# Altium schematic sheet KX1_DB_DAC_2.SchDoc
size A
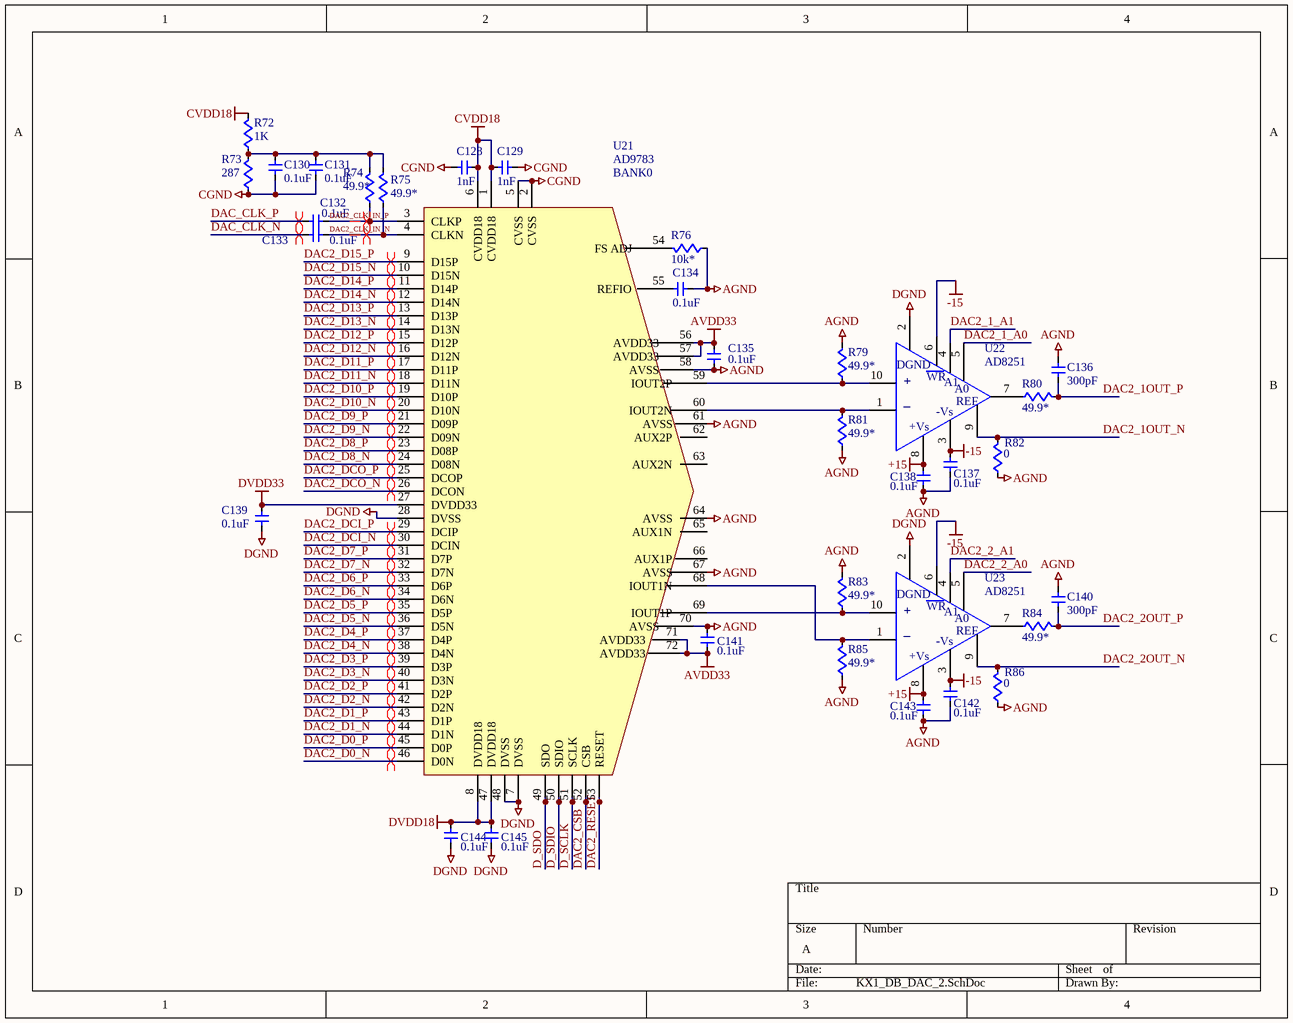
[diagram p0: KX1_DB_DAC_2.SchDoc]

## Parts
C128  1nF  [0603w]
C129  1nF  [0603w]
C130  0.1uF  [0603w]
C131  0.1uF  [0603w]
C132  0.1uF  [1206]
C133  0.1uF  [1206]
C134  0.1uF  [0603w]
C135  0.1uF  [0603w]
C136  300pF  [0603w]
C137  0.1uF  [0603w]
C138  0.1uF  [0603w]
C139  0.1uF  [0603w]
C140  300pF  [0603w]
C141  0.1uF  [0603w]
C142  0.1uF  [0603w]
C143  0.1uF  [0603w]
C144  0.1uF  [0603w]
C145  0.1uF  [0603w]
R72  1K  [0603w]
R73  287  [0603w]
R74  49.9*  [0603w]
R75  49.9*  [0603w]
R76  10k*  [0603w]
R79  49.9*  [0603w]
R80  49.9*  [0603w]
R81  49.9*  [0603w]
R82  0  [0603w]
R83  49.9*  [0603w]
R84  49.9*  [0603w]
R85  49.9*  [0603w]
R86  0  [0603w]
U21  AD9783  [LFCSP72]
U22  AD8251  [MSOP10sm]
U23  AD8251  [MSOP10sm]

## Nets
+15: C138.2 C143.2 U22.8 U23.8
-15: C137.2 C142.2 U22.3 U22.6 U23.3 U23.6
AGND: C134.2 C135.1 C136.2 C137.1 C138.1 C140.2 C141.2 C142.1 C143.1 R76.1 R79.2 R81.1 R82.1 R83.2 R85.1 R86.1 U21.58(AVSS) U21.61(AVSS) U21.64(AVSS) U21.67(AVSS) U21.70(AVSS)
AVDD33: C135.2 C141.1 U21.56(AVDD33) U21.57(AVDD33) U21.71(AVDD33) U21.72(AVDD33)
CGND: C128.2 C129.2 C130.2 C131.2 R73.1 U21.2(CVSS) U21.5(CVSS)
CVDD18: C128.1 C129.1 R72.2 U21.1(CVDD18) U21.6(CVDD18)
DGND: C139.2 C144.1 C145.1 U21.7(DVSS) U21.28(DVSS) U21.48(DVSS) U22.2 U23.2
DVDD18: C144.2 C145.2 U21.8(DVDD18) U21.47(DVDD18)
DVDD33: C139.1 U21.27(DVDD33)
D_SCLK: U21.51(SCLK)
D_SDIO: U21.50(SDIO)
D_SDO: U21.49(SDO)
DAC2_1_A0: U22.5
DAC2_1_A1: U22.4
DAC2_1OUT_N: R82.2 U22.9
DAC2_1OUT_P: C136.1 R80.2
DAC2_2_A0: U23.5
DAC2_2_A1: U23.4
DAC2_2OUT_N: R86.2 U23.9
DAC2_2OUT_P: C140.1 R84.2
DAC2_CLK_IN_N: C133.2 R75.1 U21.4(CLKN)
DAC2_CLK_IN_P: C132.2 R74.1 U21.3(CLKP)
DAC2_CSB: U21.52(CSB)
DAC2_D0_N: U21.46(D0N)
DAC2_D0_P: U21.45(D0P)
DAC2_D1_N: U21.44(D1N)
DAC2_D1_P: U21.43(D1P)
DAC2_D2_N: U21.42(D2N)
DAC2_D2_P: U21.41(D2P)
DAC2_D3_N: U21.40(D3N)
DAC2_D3_P: U21.39(D3P)
DAC2_D4_N: U21.38(D4N)
DAC2_D4_P: U21.37(D4P)
DAC2_D5_N: U21.36(D5N)
DAC2_D5_P: U21.35(D5P)
DAC2_D6_N: U21.34(D6N)
DAC2_D6_P: U21.33(D6P)
DAC2_D7_N: U21.32(D7N)
DAC2_D7_P: U21.31(D7P)
DAC2_D8_N: U21.24(D08N)
DAC2_D8_P: U21.23(D08P)
DAC2_D9_N: U21.22(D09N)
DAC2_D9_P: U21.21(D09P)
DAC2_D10_N: U21.20(D10N)
DAC2_D10_P: U21.19(D10P)
DAC2_D11_N: U21.18(D11N)
DAC2_D11_P: U21.17(D11P)
DAC2_D12_N: U21.16(D12N)
DAC2_D12_P: U21.15(D12P)
DAC2_D13_N: U21.14(D13N)
DAC2_D13_P: U21.13(D13P)
DAC2_D14_N: U21.12(D14N)
DAC2_D14_P: U21.11(D14P)
DAC2_D15_N: U21.10(D15N)
DAC2_D15_P: U21.9(D15P)
DAC2_DCI_N: U21.30(DCIN)
DAC2_DCI_P: U21.29(DCIP)
DAC2_DCO_N: U21.26(DCON)
DAC2_DCO_P: U21.25(DCOP)
DAC2_RESET: U21.53(RESET)
DAC_CLK_N: C133.1
DAC_CLK_P: C132.1
NetC130_1: C130.1 C131.1 R72.1 R73.2 R74.2 R75.2
NetC134_1: C134.1 U21.55(REFIO)
NetR76_2: R76.2 U21.54(FS_ADJ)
NetR79_1: R79.1 U21.59(IOUT2P) U22.10
NetR80_1: R80.1 U22.7
NetR81_2: R81.2 U21.60(IOUT2N) U22.1
NetR83_1: R83.1 U21.69(IOUT1P) U23.10
NetR84_1: R84.1 U23.7
NetR85_2: R85.2 U21.68(IOUT1N) U23.1

Not connected (* = marked no-connect by the designer): U21 62(AUX2P) 63(AUX2N) 65(AUX1N) 66(AUX1P)

## Layout directives
differential pair: DAC2_CLK_IN_N, DAC2_CLK_IN_P, DAC2_D0_N, DAC2_D0_P, DAC2_D1_N, DAC2_D1_P, DAC2_D2_N, DAC2_D2_P, DAC2_D3_N, DAC2_D3_P, DAC2_D4_N, DAC2_D4_P, DAC2_D5_N, DAC2_D5_P, DAC2_D6_N, DAC2_D6_P, DAC2_D7_N, DAC2_D7_P, DAC2_D8_N, DAC2_D8_P, DAC2_D9_N, DAC2_D9_P, DAC2_D10_N, DAC2_D10_P, DAC2_D11_N, DAC2_D11_P, DAC2_D12_N, DAC2_D12_P, DAC2_D13_N, DAC2_D13_P, DAC2_D14_N, DAC2_D14_P, DAC2_D15_N, DAC2_D15_P, DAC2_DCI_N, DAC2_DCI_P, DAC2_DCO_N, DAC2_DCO_P, DAC_CLK_N, DAC_CLK_P

## Notes on the sheet
- (near U21) BANK0
- (in symbol AD8251) DGND; WR; +; A1; A0; _; REF; -Vs; +Vs

## Library data of the parts
C128 C129 = CAP_SM_1: capacitor; Manufacturer: Murata Electronics North America; Manufacturer Part Number: GRM188R71H102KA01D; Capacitance: 1000pF; Voltage - Rated: 50V; Tolerance: ±10%; Temperature Coefficient: X7R; Supplier 1: Digi-Key; Supplier Part Number 1: 490-1494-1-ND; RoHS: RoHS Compliant; Category: Capacitors; Stock 1: 512721; Pricing 1: 1=0.07, 10=0.043, 50=0.0204, 100=0.0153, 250=0.01104, 500=0.00816, 1000=0.00553 (USD); Mounting Type: Surface Mount, MLCC; Operating Temperature: -55°C ~ 125°C; Applications: General Purpose; Ratings: -; Package / Case: 0603 (1608 Metric); Size / Dimension: 0.063" L x 0.031" W (1.60mm x 0.80mm); Height: -; Thickness: 0.035" (0.90mm); Lead Spacing: -; Features: -; Packaging: Cut Tape (CT); Lead Style: -; ComponentLink1URL: http://search.murata.co.jp/Ceramy/image/img/PDF/ENG/GRM188R71H102KA01.pdf; ComponentLink1Description: http://search.murata.co.jp/Ceramy/image/img/PDF/ENG/GRM188R71H102KA01.pdf
C130 = CAP_SM: capacitor; Manufacturer: Kemet; Manufacturer Part Number: C0603C104K3RACTU; Capacitance: 0.1µF; Temperature Coefficient: X7R; Tolerance: ±10%; Voltage - Rated: 25V; Applications: General Purpose; Category: Capacitors; ComponentLink1Description: http://www.kemet.com/datasheets&C0603C104K3RACTU; ComponentLink1URL: http://www.kemet.com/datasheets&C0603C104K3RACTU; Features: -; Lead Spacing: -; Lead Style: -; Mounting Type: Surface Mount, MLCC; Operating Temperature: -55°C ~ 125°C; Package / Case: 0603 (1608 Metric); Packaging: Cut Tape (CT); Pricing 1: 10=0.075, 100=0.027, 250=0.01952, 500=0.0144, 1000=0.00975 (USD); Ratings: -; RoHS: RoHS Compliant; Size / Dimension: 0.063" L x 0.032" W (1.60mm x 0.80mm); Stock 1: 2338960; Supplier 1: Digi-Key; Supplier Part Number 1: 399-1281-1-ND; Thickness: 0.80mm
C131 = CAP_SM: capacitor; Manufacturer: Kemet; Manufacturer Part Number: C0603C104K3RACTU; Capacitance: 0.1µF; Voltage - Rated: 25V; Tolerance: ±10%; Temperature Coefficient: X7R; Supplier 1: Digi-Key; Supplier Part Number 1: 399-1281-1-ND; RoHS: RoHS Compliant; Category: Capacitors; Stock 1: 2338960; Pricing 1: 10=0.075, 100=0.027, 250=0.01952, 500=0.0144, 1000=0.00975 (USD); Mounting Type: Surface Mount, MLCC; Operating Temperature: -55°C ~ 125°C; Applications: General Purpose; Ratings: -; Package / Case: 0603 (1608 Metric); Size / Dimension: 0.063" L x 0.032" W (1.60mm x 0.80mm); Thickness: 0.80mm; Lead Spacing: -; Features: -; Packaging: Cut Tape (CT); Lead Style: -; ComponentLink1URL: http://www.kemet.com/datasheets&C0603C104K3RACTU; ComponentLink1Description: http://www.kemet.com/datasheets&C0603C104K3RACTU
C132 C133 = CAP_SM_1: capacitor; Manufacturer: Murata Electronics North America; Manufacturer Part Number: GRM31C5C1E104JA01L; Capacitance: 0.1µF; Voltage - Rated: 25V; Tolerance: ±5%; Temperature Coefficient: C0G, NP0; Supplier 1: Digi-Key; Supplier Part Number 1: 490-1767-1-ND; RoHS: RoHS Compliant; Category: Capacitors; Stock 1: 374793; Pricing 1: 1=0.57, 10=0.48, 50=0.3436, 100=0.3007, 250=0.23628, 500=0.2148, 1000=0.17184 (USD); Mounting Type: Surface Mount, MLCC; Operating Temperature: -55°C ~ 125°C; Applications: General Purpose; Ratings: -; Package / Case: 1206 (3216 Metric); Size / Dimension: 0.126" L x 0.063" W (3.20mm x 1.60mm); Height: -; Thickness: 0.071" (1.80mm); Lead Spacing: -; Features: -; Packaging: Cut Tape (CT); Lead Style: -; ComponentLink1URL: http://search.murata.co.jp/Ceramy/image/img/PDF/ENG/GRM31C5C1E104JA01.pdf; ComponentLink1Description: http://search.murata.co.jp/Ceramy/image/img/PDF/ENG/GRM31C5C1E104JA01.pdf
C134 C135 C137-C139 C141-C145 = CAP_SM_1: capacitor; Manufacturer: Kemet; Manufacturer Part Number: C0603C104K3RACTU; Capacitance: 0.1µF; Temperature Coefficient: X7R; Tolerance: ±10%; Voltage - Rated: 25V; Applications: General Purpose; Category: Capacitors; ComponentLink1Description: http://www.kemet.com/datasheets&C0603C104K3RACTU; ComponentLink1URL: http://www.kemet.com/datasheets&C0603C104K3RACTU; Features: -; Lead Spacing: -; Lead Style: -; Mounting Type: Surface Mount, MLCC; Operating Temperature: -55°C ~ 125°C; Package / Case: 0603 (1608 Metric); Packaging: Cut Tape (CT); Pricing 1: 10=0.075, 100=0.027, 250=0.01952, 500=0.0144, 1000=0.00975 (USD); Ratings: -; RoHS: RoHS Compliant; Size / Dimension: 0.063" L x 0.032" W (1.60mm x 0.80mm); Stock 1: 2338960; Supplier 1: Digi-Key; Supplier Part Number 1: 399-1281-1-ND; Thickness: 0.80mm
C136 C140 = CAP_SM_1: capacitor; Supplier 1: Digi-Key; Supplier Part Number 1: 490-1438-1-ND
R72 = RES_SM: resistor; Manufacturer: Yageo; Manufacturer Part Number: RC0603FR-071KL; Power (Watts): 0.1W, 1/10W; Temperature Coefficient: ±100ppm/°C; Tolerance: ±1%; Supplier 1: Digi-Key; Supplier Part Number 1: 311-1.00KHRCT-ND; RoHS: RoHS Compliant; Category: Resistors; Stock 1: 4416298; Pricing 1: 10=0.014, 50=0.0104, 100=0.0079, 250=0.00584, 500=0.00432, 1000=0.00288 (USD); Resistance (Ohms): 1K; Composition: Thick Film; Features: -; Size / Dimension: 0.063" L x 0.031" W (1.60mm x 0.80mm); Height: 0.018" (0.45mm); Number of Terminations: 2; Packaging: Cut Tape (CT); Package / Case: 0603 (1608 Metric); ComponentLink1URL: http://www.yageo.com/documents/recent/PYu-RC0603_51_RoHS_L_4.pdf; ComponentLink1Description: http://www.yageo.com/documents/recent/PYu-RC0603_51_RoHS_L_4.pdf
R73 = RES_SM: resistor; Manufacturer: Yageo; Manufacturer Part Number: RC0603FR-07287RL; Power (Watts): 0.1W, 1/10W; Temperature Coefficient: ±100ppm/°C; Tolerance: ±1%; Supplier 1: Digi-Key; Supplier Part Number 1: 311-287HRCT-ND; RoHS: RoHS Compliant; Category: Resistors; Stock 1: 82528; Pricing 1: 10=0.014, 50=0.0104, 100=0.0079, 250=0.00584, 500=0.00432, 1000=0.00288 (USD); Resistance (Ohms): 287; Composition: Thick Film; Features: -; Size / Dimension: 0.063" L x 0.031" W (1.60mm x 0.80mm); Height: 0.018" (0.45mm); Number of Terminations: 2; Packaging: Cut Tape (CT); Package / Case: 0603 (1608 Metric); ComponentLink1URL: http://www.yageo.com/documents/recent/PYu-RC0603_51_RoHS_L_4.pdf; ComponentLink1Description: http://www.yageo.com/documents/recent/PYu-RC0603_51_RoHS_L_4.pdf
R74 R75 R79-R81 R83-R85 = RES_SM: resistor; Manufacturer: Stackpole Electronics Inc; Manufacturer Part Number: RNCS0603BKE49R9; Resistance (Ohms): 49.9; Power (Watts): 0.063W, 1/16W; Temperature Coefficient: ±25ppm/°C; Tolerance: ±0.1%; Supplier 1: Digi-Key; Supplier Part Number 1: RNCS0603BKE49R9CT-ND; RoHS: RoHS Compliant; Category: Resistors; Stock 1: 13782; Pricing 1: 1=0.7, 10=0.475, 50=0.2876, 100=0.2375, 250=0.18752, 500=0.16 (USD); Composition: Thin Film; Features: Anti-Corrosive, Moisture Resistant; Size / Dimension: 0.061" L x 0.031" W (1.55mm x 0.80mm); Height: 0.018" (0.45mm); Number of Terminations: 2; Packaging: Cut Tape (CT); Package / Case: 0603 (1608 Metric); ComponentLink1URL: http://www.seielect.com/Catalog/SEI-rncs.pdf; ComponentLink1Description: http://www.seielect.com/Catalog/SEI-rncs.pdf
R76 = RES_SM: resistor; Manufacturer: Susumu; Manufacturer Part Number: RG1608P-103-B-T5; Resistance (Ohms): 10K; Power (Watts): 0.1W, 1/10W; Temperature Coefficient: ±25ppm/°C; Tolerance: ±0.1%; Supplier 1: Digi-Key; Supplier Part Number 1: RG16P10.0KBCT-ND; RoHS: RoHS Compliant; Category: Resistors; Stock 1: 368390; Pricing 1: 10=0.409, 50=0.2478, 200=0.2047, 1000=0.10342 (USD); Composition: Thin Film; Features: -; Size / Dimension: 0.063" L x 0.031" W (1.60mm x 0.80mm); Height: 0.016" (0.40mm); Number of Terminations: 2; Packaging: Cut Tape (CT); Package / Case: 0603 (1608 Metric); ComponentLink1URL: http://www.susumu-usa.com/pdf/RG_RM_RGH_DATASHEET.pdf; ComponentLink1Description: http://www.susumu-usa.com/pdf/RG_RM_RGH_DATASHEET.pdf
R82 R86 = RES_SM: resistor; Supplier 1: Digi-Key; Supplier Part Number 1: P0.0GCT-ND
U21 = AD9783: DAC LVDS DUAL16BIT 500MSPS; Supplier 1: Digi-Key; Supplier Part Number 1: AD9783BCPZ-ND
U22 U23 = AD8251: IC AMP INST ICMOS LDRIFT 10MSOP; Supplier 1: Digi-Key; Supplier Part Number 1: AD8251ARMZ-ND